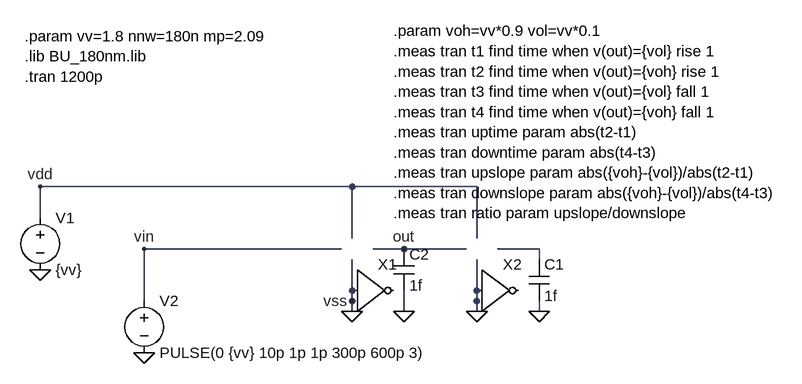
[diagram p0: schematic inv_test.asc]
inv_test.asc, the LTspice schematic file:
Version 4
SHEET 1 1168 680
WIRE 416 224 -64 224
WIRE 608 224 416 224
WIRE -64 272 -64 224
WIRE 416 304 416 224
WIRE 608 304 608 224
WIRE 400 320 96 320
WIRE 496 320 448 320
WIRE 592 320 496 320
WIRE 704 320 640 320
WIRE 704 336 704 320
WIRE 96 400 96 320
WIRE 416 400 416 336
WIRE 416 416 416 400
WIRE 496 416 496 384
WIRE 608 416 608 336
WIRE 704 416 704 400
FLAG -64 352 0
FLAG 96 480 0
FLAG 416 416 0
FLAG -64 224 vdd
FLAG 416 400 vss
FLAG 96 320 vin
FLAG 496 320 out
FLAG 704 416 0
FLAG 608 416 0
FLAG 496 416 0
SYMBOL /voltage -64 256 R0
SYMATTR InstName V1
SYMATTR Value {vv}
SYMBOL /voltage 96 384 R0
SYMATTR InstName V2
SYMATTR Value PULSE(0 {vv} 10p 1p 1p 300p 600p 3)
SYMBOL inv 416 320 R0
SYMATTR InstName X1
SYMATTR SpiceLine ll=180n wn={nnw} wp={nnw*mp}
SYMBOL inv 608 320 R0
SYMATTR InstName X2
SYMATTR SpiceLine ll=180n wn=180n wp=390n
SYMBOL /cap 688 336 R0
SYMATTR InstName C1
SYMATTR Value 1f
SYMBOL cap 480 320 R0
SYMATTR InstName C2
SYMATTR Value 1f
TEXT -88 -8 Left 2 !.param vv=1.8 nnw=180n mp=2.09\n.lib BU_180nm.lib\n.tran 1200p
TEXT 480 -16 Left 2 !.param voh=vv*0.9 vol=vv*0.1\n.meas tran t1 find time when v(out)={vol} rise 1\n.meas tran t2 find time when v(out)={voh} rise 1\n.meas tran t3 find time when v(out)={vol} fall 1\n.meas tran t4 find time when v(out)={voh} fall 1\n.meas tran uptime param abs(t2-t1)\n.meas tran downtime param abs(t4-t3)\n.meas tran upslope param abs({voh}-{vol})/abs(t2-t1)\n.meas tran downslope param abs({voh}-{vol})/abs(t4-t3)\n.meas tran ratio param upslope/downslope

The netlist it stands for:
* inv_test.asc
V1 vdd 0 {vv}
V2 vin 0 PULSE(0 {vv} 10p 1p 1p 300p 600p 3)
A§X1 0 0 0 0 0 0 0 0 BUF ll=180n wn={nnw} wp={nnw*mp}
A§X2 0 0 0 0 0 0 0 0 BUF ll=180n wn=180n wp=390n
C1 N001 0 1f
C2 out 0 1f
.param vv=1.8 nnw=180n mp=2.09
.lib BU_180nm.lib
.tran 1200p
.param voh=vv*0.9 vol=vv*0.1
.meas tran t1 find time when v(out)={vol} rise 1
.meas tran t2 find time when v(out)={voh} rise 1
.meas tran t3 find time when v(out)={vol} fall 1
.meas tran t4 find time when v(out)={voh} fall 1
.meas tran uptime param abs(t2-t1)
.meas tran downtime param abs(t4-t3)
.meas tran upslope param abs({voh}-{vol})/abs(t2-t1)
.meas tran downslope param abs({voh}-{vol})/abs(t4-t3)
.meas tran ratio param upslope/downslope
.backanno
.end

* Results of the author's LTspice run, read from the files saved beside the schematic
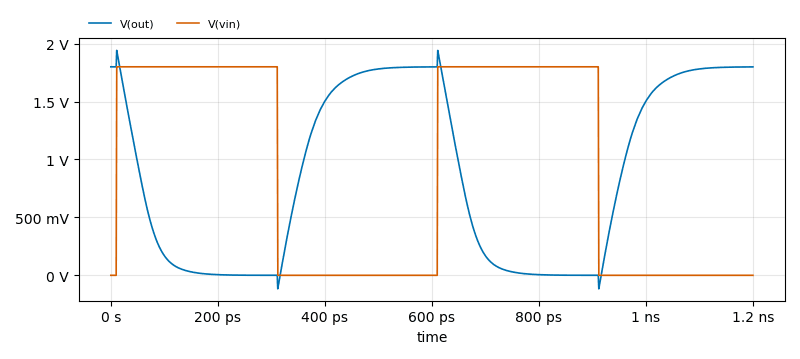
[diagram p1: Transient Analysis of inv_test.asc, plotted from the saved traces]
* Transient Analysis, 1 run:
*   V(out): min -116.5 mV, max 1.942 V, average 880.4 mV, rms 1.175 V, last 1.799 V
*   V(vin): min 0 V, max 1.8 V, average 903 mV, rms 1.274 V, last 0 V
* From the log:
*   t1: time=3.23419e-10 at 3.23419e-10
*   t2: time=4.1965e-10 at 4.1965e-10
*   t3: time=9.84792e-11 at 9.84792e-11
*   t4: time=2.36263e-11 at 2.36263e-11
*   uptime: abs(t2-t1)=9.62306e-11
*   downtime: abs(t4-t3)=7.48529e-11
*   upslope: abs( 1.62 - 0.18 )/abs(t2-t1)=1.49641e+10
*   downslope: abs( 1.62 - 0.18 )/abs(t4-t3)=1.92377e+10
*   ratio: upslope/downslope=0.777849